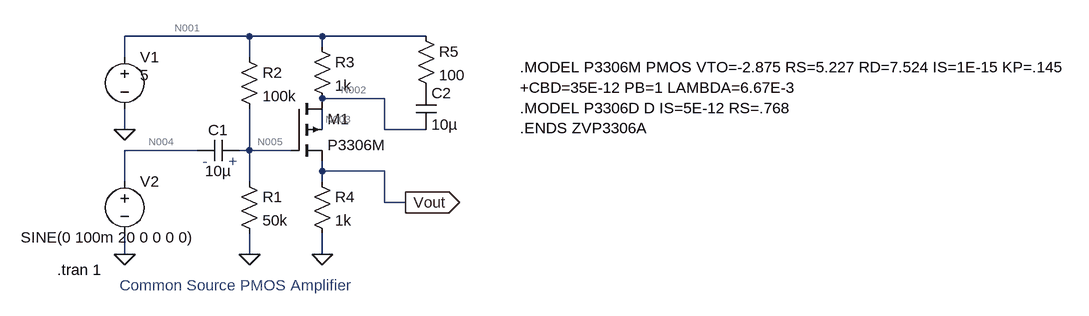
[diagram p0: schematic Draft3.asc]
Draft3.asc, the LTspice schematic file:
Version 4
SHEET 1 1116 680
WIRE -192 -48 -384 -48
WIRE -80 -48 -192 -48
WIRE 80 -48 -80 -48
WIRE -80 -32 -80 -48
WIRE -384 -16 -384 -48
WIRE -192 -16 -192 -48
WIRE 16 48 -80 48
WIRE -384 96 -384 64
WIRE -80 96 -80 64
WIRE 16 96 16 48
WIRE 80 96 16 96
WIRE -272 128 -384 128
WIRE -192 128 -192 64
WIRE -192 128 -208 128
WIRE -128 128 -192 128
WIRE -80 160 -80 144
WIRE 16 160 -80 160
WIRE -384 176 -384 128
WIRE -192 176 -192 128
WIRE -80 176 -80 160
WIRE 16 208 16 160
WIRE 48 208 16 208
WIRE -384 288 -384 256
WIRE -192 288 -192 256
WIRE -80 288 -80 256
FLAG -384 96 0
FLAG -192 288 0
FLAG -80 288 0
FLAG 48 208 Vout
IOPIN 48 208 Out
FLAG -384 288 0
SYMBOL voltage -384 -32 R0
WINDOW 3 24 44 Left 2
WINDOW 123 0 0 Left 0
WINDOW 39 0 0 Left 0
SYMATTR Value 5
SYMATTR InstName V1
SYMBOL res -208 160 R0
SYMATTR InstName R1
SYMATTR Value 50k
SYMBOL res -208 -32 R0
SYMATTR InstName R2
SYMATTR Value 100k
SYMBOL cap -208 112 R90
WINDOW 0 0 32 VBottom 2
WINDOW 3 32 32 VTop 2
SYMATTR InstName C1
SYMATTR Value 10µ
SYMBOL voltage -384 160 R0
WINDOW 3 -160 102 Left 2
WINDOW 123 0 0 Left 0
WINDOW 39 0 0 Left 0
SYMATTR Value SINE(0 100m 20 0 0 0 0)
SYMATTR InstName V2
SYMBOL res -96 -48 R0
SYMATTR InstName R3
SYMATTR Value 1k
SYMBOL pmos4 -128 48 R0
SYMATTR InstName M1
SYMATTR Value P3306M
SYMBOL res -96 160 R0
SYMATTR InstName R4
SYMATTR Value 1k
SYMBOL res 64 -64 R0
SYMATTR InstName R5
SYMATTR Value 100
SYMBOL cap 64 32 R0
SYMATTR InstName C2
SYMATTR Value 10µ
TEXT -224 144 Left 2 ;+
TEXT -264 144 Left 2 ;-
TEXT -488 312 Left 2 !.tran 1
TEXT -392 336 Left 2 ;Common Source PMOS Amplifier
TEXT 224 0 Left 2 !.MODEL P3306M PMOS VTO=-2.875 RS=5.227 RD=7.524 IS=1E-15 KP=.145\n+CBD=35E-12 PB=1 LAMBDA=6.67E-3\n.MODEL P3306D D IS=5E-12 RS=.768\n.ENDS ZVP3306A

The netlist it stands for:
* Draft3.asc
V1 N001 0 5
R1 N005 0 50k
R2 N001 N005 100k
C1 N005 N004 10µ
V2 N004 0 SINE(0 100m 20 0 0 0 0)
R3 N001 N002 1k
M1 N002 N005 Vout N003 P3306M
R4 Vout 0 1k
R5 N001 P001 100
C2 P001 N002 10µ
.model NMOS NMOS
.model PMOS PMOS
.lib standard.mos
* +
* -
.tran 1
* Common Source PMOS Amplifier
.MODEL P3306M PMOS VTO=-2.875 RS=5.227 RD=7.524 IS=1E-15 KP=.145
+CBD=35E-12 PB=1 LAMBDA=6.67E-3
.MODEL P3306D D IS=5E-12 RS=.768
.ENDS ZVP3306A
.backanno
.end

* Results of the author's LTspice run, read from the files saved beside the schematic
* Operating Point, zero values left out:
*   V(n001) = 5 V
*   V(n005) = 1.667 V
*   V(n002) = 4.616 V
*   V(vout) = 383.7 mV
*   V(n003) = 4.38 V
*   V(p001) = 5 V
*   Id(M1) = 383.7 µA
*   Ib(M1) = -4.422 pA
*   Is(M1) = -383.7 µA
*   I(R4) = 383.7 µA
*   I(R3) = 383.7 µA
*   I(R2) = 33.33 µA
*   I(R1) = 33.33 µA
*   I(V1) = -417 µA
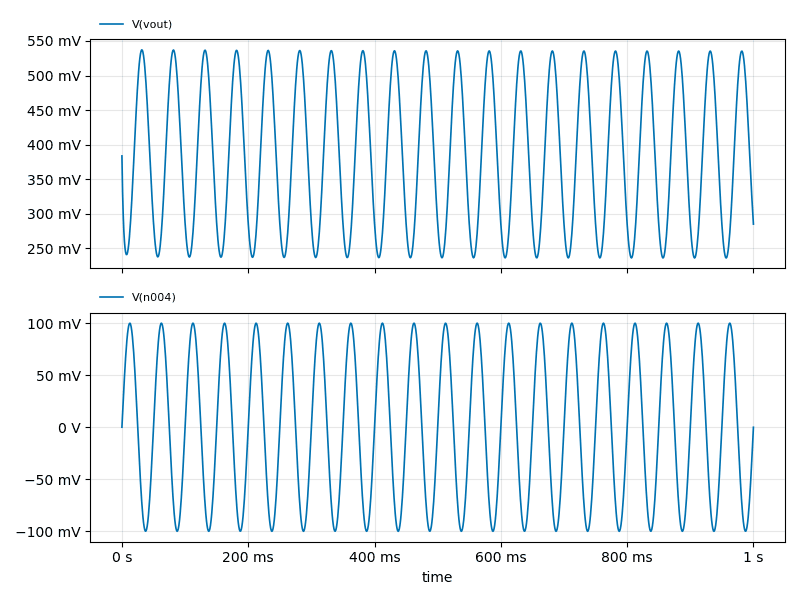
[diagram p1: Transient Analysis of Draft3.asc, plotted from the saved traces]
* Transient Analysis, 1 run:
*   V(vout): min 236 mV, max 537.1 mV, average 385.2 mV, rms 399.5 mV, last 285 mV
*   V(n004): min -100 mV, max 100 mV, average 66.59 nV, rms 70.71 mV, last 0 V